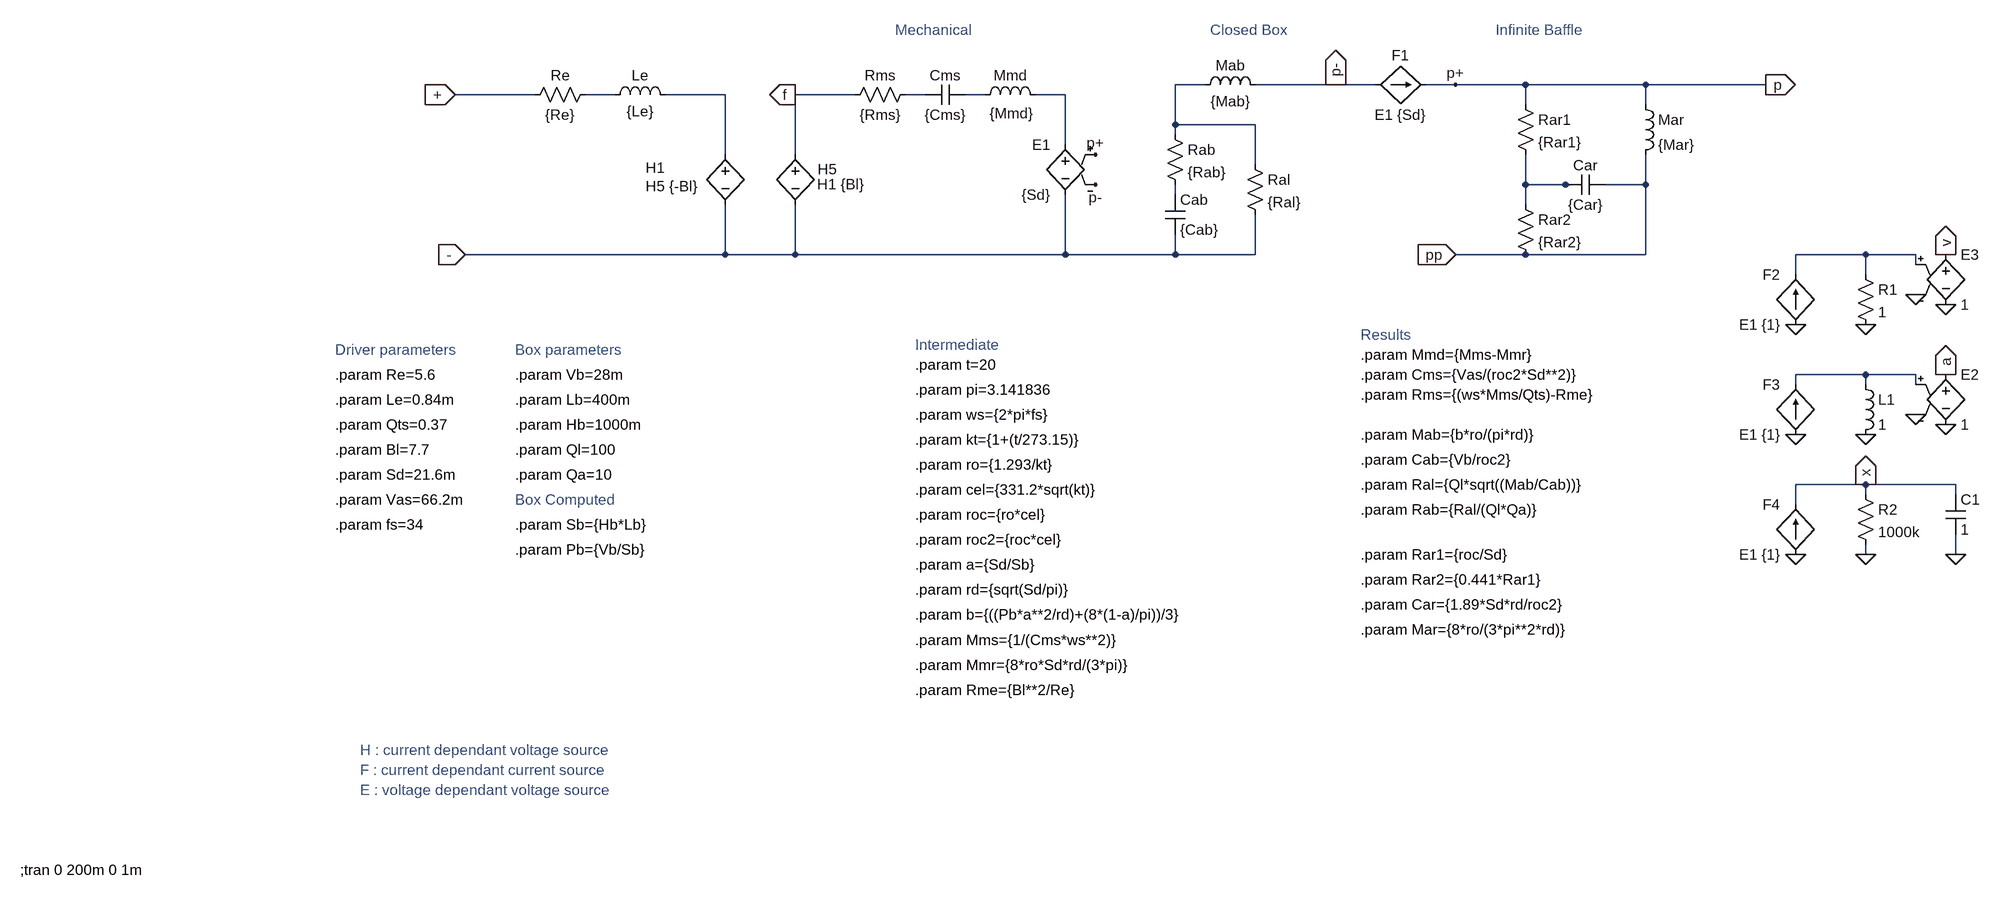
[diagram p0: schematic speaker-closed-box.asc]
speaker-closed-box.asc, the LTspice schematic file:
Version 4
SHEET 1 3864 3176
WIRE 832 1904 784 1904
WIRE 1040 1904 912 1904
WIRE 1104 1904 1040 1904
WIRE 1232 1904 1184 1904
WIRE 1344 1904 1232 1904
WIRE 1536 1904 1344 1904
WIRE 1728 1904 1536 1904
WIRE -240 1920 -368 1920
WIRE -112 1920 -160 1920
WIRE 64 1920 -32 1920
WIRE 272 1920 176 1920
WIRE 384 1920 352 1920
WIRE 480 1920 448 1920
WIRE 608 1920 560 1920
WIRE 1344 1936 1344 1904
WIRE 1536 1936 1536 1904
WIRE 784 1968 784 1904
WIRE 912 1968 784 1968
WIRE 784 1984 784 1968
WIRE 608 2000 608 1920
WIRE 64 2016 64 1920
WIRE 176 2016 176 1920
WIRE 912 2032 912 1968
WIRE 1344 2064 1344 2016
WIRE 1408 2064 1344 2064
WIRE 1424 2064 1408 2064
WIRE 1536 2064 1536 2016
WIRE 1536 2064 1472 2064
WIRE 784 2080 784 2064
WIRE 1344 2096 1344 2064
WIRE 64 2176 64 2096
WIRE 64 2176 -352 2176
WIRE 176 2176 176 2096
WIRE 176 2176 64 2176
WIRE 608 2176 608 2080
WIRE 608 2176 176 2176
WIRE 784 2176 784 2144
WIRE 784 2176 608 2176
WIRE 912 2176 912 2112
WIRE 912 2176 784 2176
WIRE 1344 2176 1232 2176
WIRE 1536 2176 1536 2064
WIRE 1536 2176 1344 2176
WIRE 1888 2176 1776 2176
WIRE 1968 2176 1888 2176
WIRE 1968 2192 1968 2176
WIRE 1776 2208 1776 2176
WIRE 1888 2208 1888 2176
WIRE 1888 2368 1776 2368
WIRE 1968 2368 1888 2368
WIRE 1776 2384 1776 2368
WIRE 1888 2384 1888 2368
WIRE 1968 2384 1968 2368
WIRE 1888 2544 1776 2544
WIRE 2032 2544 1888 2544
WIRE 1888 2560 1888 2544
WIRE 2032 2560 2032 2544
WIRE 1776 2576 1776 2544
WIRE 1888 2656 1888 2640
WIRE 2032 2656 2032 2624
FLAG 1776 2288 0
FLAG 1776 2464 0
FLAG 1776 2656 0
FLAG 1888 2288 0
FLAG 2016 2176 v
IOPIN 2016 2176 Out
FLAG 1888 2464 0
FLAG 1888 2656 0
FLAG 1888 2544 x
IOPIN 1888 2544 Out
FLAG 2032 2656 0
FLAG 1728 1904 p
IOPIN 1728 1904 Out
FLAG -368 1920 +
IOPIN -368 1920 In
FLAG -352 2176 -
IOPIN -352 2176 In
FLAG 1232 1904 p+
FLAG 656 2016 p+
FLAG 656 2064 p-
FLAG 1040 1904 p-
IOPIN 1040 1904 Out
FLAG 1232 2176 pp
IOPIN 1232 2176 In
FLAG 176 1920 f
IOPIN 176 1920 Out
FLAG 2016 2368 a
IOPIN 2016 2368 Out
FLAG 1968 2432 0
FLAG 2016 2448 0
FLAG 1968 2240 0
FLAG 2016 2256 0
SYMBOL res -256 1936 R270
WINDOW 0 32 56 VTop 2
WINDOW 3 0 56 VBottom 2
SYMATTR InstName Re
SYMATTR Value {Re}
SYMBOL h 64 2000 R0
WINDOW 0 -127 37 Left 2
WINDOW 3 -127 66 Left 2
SYMATTR InstName H1
SYMATTR Value H5 {-Bl}
SYMBOL res 368 1904 R90
WINDOW 0 0 56 VBottom 2
WINDOW 3 32 56 VTop 2
SYMATTR InstName Rms
SYMATTR Value {Rms}
SYMBOL cap 448 1904 R90
WINDOW 0 0 32 VBottom 2
WINDOW 3 32 32 VTop 2
SYMATTR InstName Cms
SYMATTR Value {Cms}
SYMBOL ind 464 1936 R270
WINDOW 0 32 56 VTop 2
WINDOW 3 2 58 VBottom 2
SYMATTR InstName Mmd
SYMATTR Value {Mmd}
SYMATTR SpiceLine Rser=0
SYMBOL ind -128 1936 R270
WINDOW 0 32 56 VTop 2
WINDOW 3 5 56 VBottom 2
SYMATTR InstName Le
SYMATTR Value {Le}
SYMBOL cap 768 2080 R0
SYMATTR InstName Cab
SYMATTR Value {Cab}
SYMBOL res 768 1968 R0
SYMATTR InstName Rab
SYMATTR Value {Rab}
SYMBOL res 1328 1920 R0
SYMATTR InstName Rar1
SYMATTR Value {Rar1}
SYMBOL ind 1520 1920 R0
SYMATTR InstName Mar
SYMATTR Value {Mar}
SYMBOL h 176 2000 R0
WINDOW 0 36 39 Left 2
WINDOW 3 35 63 Left 2
SYMATTR InstName H5
SYMATTR Value H1 {Bl}
SYMBOL res 896 2016 R0
SYMATTR InstName Ral
SYMATTR Value {Ral}
SYMBOL ind 928 1920 M270
WINDOW 0 32 56 VTop 2
WINDOW 3 5 56 VBottom 2
SYMATTR InstName Mab
SYMATTR Value {Mab}
SYMBOL cap 1472 2048 R90
WINDOW 0 0 32 VBottom 2
WINDOW 3 32 32 VTop 2
SYMATTR InstName Car
SYMATTR Value {Car}
SYMBOL res 1328 2080 R0
SYMATTR InstName Rar2
SYMATTR Value {Rar2}
SYMBOL e 608 1984 M0
SYMATTR InstName E1
SYMATTR Value {Sd}
SYMBOL f 1104 1904 R270
WINDOW 0 32 40 VTop 2
WINDOW 3 -32 40 VBottom 2
SYMATTR InstName F1
SYMATTR Value E1 {Sd}
SYMBOL f 1776 2288 R180
WINDOW 0 24 80 Left 2
WINDOW 3 24 0 Left 2
SYMATTR InstName F2
SYMATTR Value E1 {1}
SYMBOL f 1776 2464 R180
WINDOW 0 24 80 Left 2
WINDOW 3 24 0 Left 2
SYMATTR InstName F3
SYMATTR Value E1 {1}
SYMBOL f 1776 2656 R180
WINDOW 0 24 80 Left 2
WINDOW 3 24 0 Left 2
SYMATTR InstName F4
SYMATTR Value E1 {1}
SYMBOL res 1872 2192 R0
SYMATTR InstName R1
SYMATTR Value 1
SYMBOL ind 1872 2368 R0
SYMATTR InstName L1
SYMATTR Value 1
SYMBOL cap 2016 2560 R0
SYMATTR InstName C1
SYMATTR Value 1
SYMBOL res 1872 2544 R0
SYMATTR InstName R2
SYMATTR Value 1000k
SYMBOL e 2016 2352 R0
SYMATTR InstName E2
SYMATTR Value 1
SYMBOL e 2016 2160 R0
SYMATTR InstName E3
SYMATTR Value 1
TEXT -560 2368 Left 2 !.param Re=5.6
TEXT -560 2328 Left 2 ;Driver parameters
TEXT -560 2408 Left 2 !.param Le=0.84m
TEXT -560 2488 Left 2 !.param Bl=7.7
TEXT 368 2320 Left 2 ;Intermediate
TEXT -560 2528 Left 2 !.param Sd=21.6m
TEXT -272 2328 Left 2 ;Box parameters
TEXT -272 2368 Left 2 !.param Vb=28m
TEXT -520 2968 Left 2 ;H : current dependant voltage source
TEXT -520 3000 Left 2 ;F : current dependant current source
TEXT -520 3032 Left 2 ;E : voltage dependant voltage source
TEXT 1080 2304 Left 2 ;Results
TEXT 1080 2504 Left 2 !.param Cab={Vb/roc2}
TEXT 1080 2656 Left 2 !.param Rar1={roc/Sd}
TEXT 1080 2696 Left 2 !.param Rar2={0.441*Rar1}
TEXT 1080 2736 Left 2 !.param Car={1.89*Sd*rd/roc2}
TEXT 1080 2776 Left 2 !.param Mar={8*ro/(3*pi**2*rd)}
TEXT 368 2712 Left 2 !.param rd={sqrt(Sd/pi)}
TEXT 336 1816 Left 2 ;Mechanical
TEXT 840 1816 Left 2 ;Closed Box
TEXT 1296 1816 Left 2 ;Infinite Baffle
TEXT -1064 3160 Left 2 !;tran 0 200m 0 1m
TEXT 368 2352 Left 2 !.param t=20
TEXT 368 2472 Left 2 !.param kt={1+(t/273.15)}
TEXT 368 2512 Left 2 !.param ro={1.293/kt}
TEXT 368 2552 Left 2 !.param cel={331.2*sqrt(kt)}
TEXT 368 2592 Left 2 !.param roc={ro*cel}
TEXT 368 2632 Left 2 !.param roc2={roc*cel}
TEXT -272 2408 Left 2 !.param Lb=400m
TEXT -272 2448 Left 2 !.param Hb=1000m
TEXT -272 2568 Left 2 ;Box Computed
TEXT -272 2608 Left 2 !.param Sb={Hb*Lb}
TEXT -272 2648 Left 2 !.param Pb={Vb/Sb}
TEXT 368 2672 Left 2 !.param a={Sd/Sb}
TEXT 368 2752 Left 2 !.param b={((Pb*a**2/rd)+(8*(1-a)/pi))/3}
TEXT 1080 2464 Left 2 !.param Mab={b*ro/(pi*rd)}
TEXT 1080 2544 Left 2 !.param Ral={Ql*sqrt((Mab/Cab))}
TEXT -272 2488 Left 2 !.param Ql=100
TEXT -272 2528 Left 2 !.param Qa=10
TEXT 1080 2584 Left 2 !.param Rab={Ral/(Ql*Qa)}
TEXT 368 2392 Left 2 !.param pi=3.141836
TEXT 1080 2368 Left 2 !.param Cms={Vas/(roc2*Sd**2)}
TEXT 1080 2336 Left 2 !.param Mmd={Mms-Mmr}
TEXT -560 2568 Left 2 !.param Vas=66.2m
TEXT 368 2432 Left 2 !.param ws={2*pi*fs}
TEXT -560 2608 Left 2 !.param fs=34
TEXT 368 2792 Left 2 !.param Mms={1/(Cms*ws**2)}
TEXT 368 2832 Left 2 !.param Mmr={8*ro*Sd*rd/(3*pi)}
TEXT 1080 2400 Left 2 !.param Rms={(ws*Mms/Qts)-Rme}
TEXT 368 2872 Left 2 !.param Rme={Bl**2/Re}
TEXT -560 2448 Left 2 !.param Qts=0.37

The netlist it stands for:
* speaker-closed-box.asc
Re + N002 {Re}
H1 N003 - H5 {-Bl}
Rms N004 f {Rms}
Cms N005 N004 {Cms}
L§Mmd N005 N006 {Mmd} Rser=0
Le N002 N003 {Le}
Cab N008 - {Cab}
Rab N001 N008 {Rab}
Rar1 p+ N007 {Rar1}
L§Mar p+ pp {Mar}
H5 f - H1 {Bl}
Ral N001 - {Ral}
L§Mab p- N001 {Mab}
Car pp N007 {Car}
Rar2 N007 pp {Rar2}
E1 N006 - p+ p- {Sd}
F1 p- p+ E1 {Sd}
F2 0 N009 E1 {1}
F3 0 N010 E1 {1}
F4 0 x E1 {1}
R1 N009 0 1
L1 N010 0 1
C1 x 0 1
R2 x 0 1000k
E2 a 0 N010 0 1
E3 v 0 N009 0 1
.param Re=5.6
* Driver parameters
.param Le=0.84m
.param Bl=7.7
* Intermediate
.param Sd=21.6m
* Box parameters
.param Vb=28m
* H : current dependant voltage source
* F : current dependant current source
* E : voltage dependant voltage source
* Results
.param Cab={Vb/roc2}
.param Rar1={roc/Sd}
.param Rar2={0.441*Rar1}
.param Car={1.89*Sd*rd/roc2}
.param Mar={8*ro/(3*pi**2*rd)}
.param rd={sqrt(Sd/pi)}
* Mechanical
* Closed Box
* Infinite Baffle
;tran 0 200m 0 1m
.param t=20
.param kt={1+(t/273.15)}
.param ro={1.293/kt}
.param cel={331.2*sqrt(kt)}
.param roc={ro*cel}
.param roc2={roc*cel}
.param Lb=400m
.param Hb=1000m
* Box Computed
.param Sb={Hb*Lb}
.param Pb={Vb/Sb}
.param a={Sd/Sb}
.param b={((Pb*a**2/rd)+(8*(1-a)/pi))/3}
.param Mab={b*ro/(pi*rd)}
.param Ral={Ql*sqrt((Mab/Cab))}
.param Ql=100
.param Qa=10
.param Rab={Ral/(Ql*Qa)}
.param pi=3.141836
.param Cms={Vas/(roc2*Sd**2)}
.param Mmd={Mms-Mmr}
.param Vas=66.2m
.param ws={2*pi*fs}
.param fs=34
.param Mms={1/(Cms*ws**2)}
.param Mmr={8*ro*Sd*rd/(3*pi)}
.param Rms={(ws*Mms/Qts)-Rme}
.param Rme={Bl**2/Re}
.param Qts=0.37
.backanno
.end